# EAGLE design board1 (EAGLE 9.6.2)
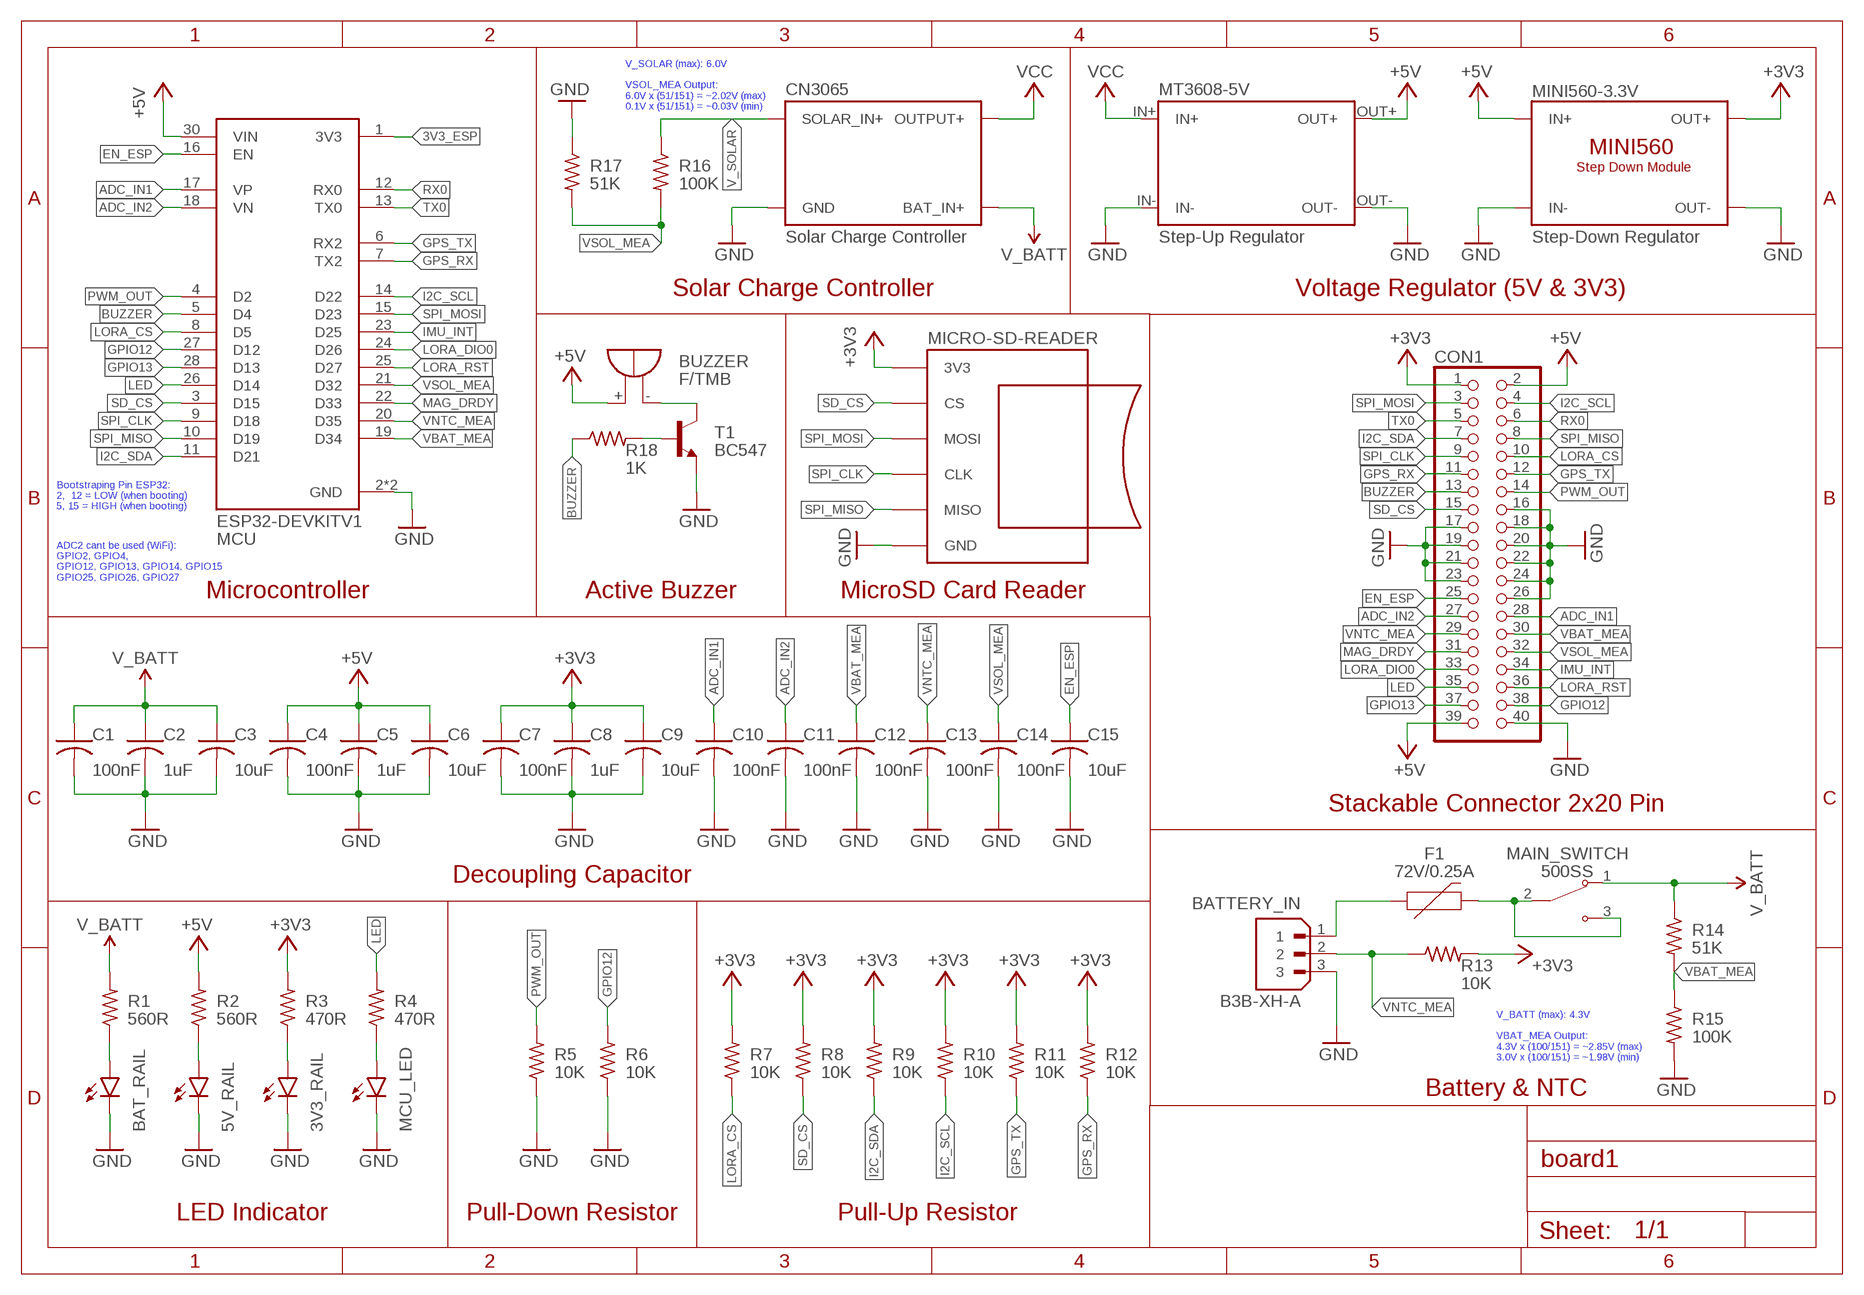
[diagram p0: schematic, sheet 1]

## Parts
3V3_RAIL  LEDCHIP-LED0805  [CHIP-LED0805]
5V_RAIL  LEDCHIP-LED0805  [CHIP-LED0805]
BAT_RAIL  LEDCHIP-LED0805  [CHIP-LED0805]
BATTERY_IN  B3B-XH-A  [JST_B3B-XH-A]
BUZZER  F/TMB  [F/TMB]
C1  100nF  C-USC0805  [C0805]
C2  1uF  C-USC0805  [C0805]
C3  10uF  C-USC0805  [C0805]
C4  100nF  C-USC0805  [C0805]
C5  1uF  C-USC0805  [C0805]
C6  10uF  C-USC0805  [C0805]
C7  100nF  C-USC0805  [C0805]
C8  1uF  C-USC0805  [C0805]
C9  10uF  C-USC0805  [C0805]
C10  100nF  C-USC0805  [C0805]
C11  100nF  C-USC0805  [C0805]
C12  100nF  C-USC0805  [C0805]
C13  100nF  C-USC0805  [C0805]
C14  100nF  C-USC0805  [C0805]
C15  10uF  C-USC0805  [C0805]
CN3065  Solar Charge Controller  CN3065  [CN3065]
CON1  PINHD-2X20  [2X20]
ESP32-DEVKITV1  MCU  ESP32-DEVKIT-V1  [MODULE_ESP32_DEVKIT_V1]
F1  72V/0.25A  PPTC_PTH  [PTH]
MAIN_SWITCH  500SS  500SSP1S1M2REA  [SW_500SSP1S1M2REA]
MCU_LED  LEDCHIP-LED0805  [CHIP-LED0805]
MICRO-SD-READER  MICROSD-READERUP-TOP  [MICROSD-READER-FACING_UP(TOP_LAYER)]
MINI560-3.3V  Step-Down Regulator  MINI560_W/O_ENTHT  [MINI560-THT]
MT3608-5V  Step-Up Regulator  MT3608  [MT3608]
R1  560R  R-US_R0805  [R0805]
R2  560R  R-US_R0805  [R0805]
R3  470R  R-US_R0805  [R0805]
R4  470R  R-US_R0805  [R0805]
R5  10K  R-US_R0805  [R0805]
R6  10K  R-US_R0805  [R0805]
R7  10K  R-US_R0805  [R0805]
R8  10K  R-US_R0805  [R0805]
R9  10K  R-US_R0805  [R0805]
R10  10K  R-US_R0805  [R0805]
R11  10K  R-US_R0805  [R0805]
R12  10K  R-US_R0805  [R0805]
R13  10K  R-US_R0805  [R0805]
R14  51K  R-US_R0805  [R0805]
R15  100K  R-US_R0805  [R0805]
R16  100K  R-US_R0805  [R0805]
R17  51K  R-US_R0805  [R0805]
R18  1K  R-US_R0805  [R0805]
T1  BC547  [TO92]

## Nets
3V3_ESP: ESP32-DEVKITV1.1(3V3)
+3V3: C7.1 C8.1 C9.1 CON1.1 MICRO-SD-READER.3V3 MINI560-3.3V.1OUT+(OUT+) MINI560-3.3V.2OUT+(OUT+) R3.2 R7.2 R8.2 R9.2 R10.2 R11.2 R12.2 R13.2
+5V: BUZZER.+ C4.1 C5.1 C6.1 CON1.2 CON1.39 ESP32-DEVKITV1.30(VIN) MINI560-3.3V.1IN+(IN+) MINI560-3.3V.2IN+(IN+) MT3608-5V.OUT+ R2.2
ADC_IN1: C10.1 CON1.28 ESP32-DEVKITV1.17(VP)
ADC_IN2: C11.1 CON1.27 ESP32-DEVKITV1.18(VN)
BUZZER: CON1.13 ESP32-DEVKITV1.5(D4) R18.1
EN_ESP: C15.1 CON1.25 ESP32-DEVKITV1.16(EN)
GND: 3V3_RAIL.C 5V_RAIL.C BAT_RAIL.C BATTERY_IN.3 C1.2 C2.2 C3.2 C4.2 C5.2 C6.2 C7.2 C8.2 C9.2 C10.2 C11.2 C12.2 C13.2 C14.2 C15.2 CN3065.BAT-(GND) CN3065.OUT-(GND) CN3065.SC-(GND) CON1.16 CON1.17 CON1.18 CON1.19 CON1.20 CON1.21 CON1.22 CON1.23 CON1.24 CON1.26 CON1.40 ESP32-DEVKITV1.2(GND) ESP32-DEVKITV1.29(GND) MCU_LED.C MICRO-SD-READER.GND MINI560-3.3V.1IN-(IN-) MINI560-3.3V.1OUT-(OUT-) MINI560-3.3V.2IN-(IN-) MINI560-3.3V.2OUT-(OUT-) MT3608-5V.IN- MT3608-5V.OUT- R5.1 R6.1 R15.2 R17.1 T1.1(E)
GPIO12: CON1.38 ESP32-DEVKITV1.27(D12) R6.2
GPIO13: CON1.37 ESP32-DEVKITV1.28(D13)
GPS_RX: CON1.11 ESP32-DEVKITV1.7(TX2) R12.1
GPS_TX: CON1.12 ESP32-DEVKITV1.6(RX2) R11.1
I2C_SCL: CON1.4 ESP32-DEVKITV1.14(D22) R10.1
I2C_SDA: CON1.7 ESP32-DEVKITV1.11(D21) R9.1
IMU_INT: CON1.34 ESP32-DEVKITV1.23(D25)
LED: CON1.35 ESP32-DEVKITV1.26(D14) R4.2
LORA_CS: CON1.10 ESP32-DEVKITV1.8(D5) R7.1
LORA_DIO0: CON1.33 ESP32-DEVKITV1.24(D26)
LORA_RST: CON1.36 ESP32-DEVKITV1.25(D27)
MAG_DRDY: CON1.31 ESP32-DEVKITV1.22(D33)
N$1: BATTERY_IN.1 F1.P$1
N$2: BUZZER.- T1.3(C)
N$3: F1.P$2 MAIN_SWITCH.2(COM) MAIN_SWITCH.3(NO)
N$4: R18.2 T1.2(B)
N$5: MCU_LED.A R4.1
N$6: 3V3_RAIL.A R3.1
N$8: BAT_RAIL.A R1.1
N$11: 5V_RAIL.A R2.1
PWM_OUT: CON1.14 ESP32-DEVKITV1.4(D2) R5.2
RX0: CON1.6 ESP32-DEVKITV1.12(RX0)
SD_CS: CON1.15 ESP32-DEVKITV1.3(D15) MICRO-SD-READER.CS R8.1
SPI_CLK: CON1.9 ESP32-DEVKITV1.9(D18) MICRO-SD-READER.CLK
SPI_MISO: CON1.8 ESP32-DEVKITV1.10(D19) MICRO-SD-READER.MISO
SPI_MOSI: CON1.3 ESP32-DEVKITV1.15(D23) MICRO-SD-READER.MOSI
TX0: CON1.5 ESP32-DEVKITV1.13(TX0)
V_BATT: C1.1 C2.1 C3.1 CN3065.BAT+(BAT_IN+) MAIN_SWITCH.1(NC) R1.2 R14.1
V_SOLAR: CN3065.SC+(SOLAR_IN+) R16.1
VBAT_MEA: C12.1 CON1.30 ESP32-DEVKITV1.19(D34) R14.2 R15.1
VCC: CN3065.OUT+(OUTPUT+) MT3608-5V.IN+
VNTC_MEA: BATTERY_IN.2 C13.1 CON1.29 ESP32-DEVKITV1.20(D35) R13.1
VSOL_MEA: C14.1 CON1.32 ESP32-DEVKITV1.21(D32) R16.2 R17.2

## Notes on the sheet
- V_SOLAR (max): 6.0V
  
  VSOL_MEA Output: 
  6.0V x (51/151) = ~2.02V (max)
  0.1V x (51/151) = ~0.03V (min)
- Solar Charge Controller | Voltage Regulator (5V & 3V3)
- Bootstraping Pin ESP32:
  2,  12 = LOW (when booting)
  5, 15 = HIGH (when booting)
- ADC2 cant be used (WiFi):
  GPIO2, GPIO4, 
  GPIO12, GPIO13, GPIO14, GPIO15
  GPIO25, GPIO26, GPIO27
- Microcontroller | Active Buzzer | MicroSD Card Reader
- Stackable Connector 2x20 Pin
- Decoupling Capacitor
- V_BATT (max): 4.3V
  
  VBAT_MEA Output: 
  4.3V x (100/151) = ~2.85V (max)
  3.0V x (100/151) = ~1.98V (min)
- Battery & NTC
- LED Indicator | Pull-Down Resistor | Pull-Up Resistor

## Library data of the parts
3V3_RAIL 5V_RAIL BAT_RAIL MCU_LED = led:LED: LED OSRAM: - CHIPLED LG R971, LG N971, LY N971, LG Q971, LY Q971, LO R971, LY R971 LH N974, LH R974 LS Q976, LO Q976, LY Q976 LO Q996 - Hyper CHIPLED LW Q18S LB Q993, LB Q99A, LB R99A - SideLED LS A670, LO A670, LY A670, LG A670, LP A670 LB A673, LV A673, LT A673, LW A673 LH A674 LY A675 LS A676, LA A676, LO A676, LY A676, LW A676 LS A679, LY A679, LG A679 - Hyper Micro SIDELED® LS Y876, LA Y876, LO Y876, LY Y876 LT Y87S - SmartLED LW L88C, LW L88S LB L89C, LB L89S, LG L890 LS L89K, LO L89K, LY L89K LS L896, LA L896, LO L896, LY L896 - TOPLED LS T670, LO T670, LY T670, LG T670, LP T670 LSG T670, LSP T670, LSY T670, LOP T670, LYG T670 LG T671, LOG T671, LSG T671 LB T673, LV T673, LT T673, LW T673 LH T674 LS T676, LA T676, LO T676, LY T676, LB T676, LH T676, LSB T676, LW T676 LB T67C, LV T67C, LT T67C, LS T67K, LO T67K, LY T67K, LW E67C LS E67B, LA E67B, LO E67B, LY E67B, LB E67C, LV E67C, LT E67C LW T67C LS T679, LY T679, LG T679 LS T770, LO T770, LY T770, LG T770, LP T770 LB T773, LV T773, LT T773, LW T773 LH T774 LS E675, LA E675, LY E675, LS T675 LS T776, LA T776, LO T776, LY T776, LB T776 LHGB T686 LT T68C, LB T68C - Hyper Mini TOPLED® LB M676 - Mini TOPLED Santana® LG M470 LS M47K, LO M47K, LY M47K Source: http://www.osram.convergy.de LUXEON: - LUMILED® LXK2-PW12-R00, LXK2-PW12-S00, LXK2-PW14-U00, LXK2-PW14-V00 LXK2-PM12-R00, LXK2-PM12-S00, LXK2-PM14-U00 LXK2-PE12-Q00, LXK2-PE12-R00, LXK2-PE12-S00, LXK2-PE14-T00, LXK2-PE14-U00 LXK2-PB12-K00, LXK2-PB12-L00, LXK2-PB12-M00, LXK2-PB14-N00, LXK2-PB14-P00, LXK2-PB14-Q00 LXK2-PR12-L00, LXK2-PR12-M00, LXK2-PR14-Q00, LXK2-PR14-R00 LXK2-PD12-Q00, LXK2-PD12-R00, LXK2-PD12-S00 LXK2-PH12-R00, LXK2-PH12-S00 LXK2-PL12-P00, LXK2-PL12-Q00, LXK2-PL12-R00 Source: www.luxeon.com KINGBRIGHT: KA-3528ASYC Source: www.kingbright.com
BATTERY_IN = B3B-XH-A:B3B-XH-A: Check availability <https://pricing.snapeda.com/parts/B3B-XH-A/JST%20Sales/view-part?ref=eda>; AVAILABILITY: In Stock; CHECK_PRICES: https://www.snapeda.com/parts/B3B-XH-A/JST+Sales+America+Inc./view-part/?ref=eda; DESCRIPTION: Connector Header Through Hole 3 position 0.098 (2.50mm); MF: JST Sales; MP: B3B-XH-A; PACKAGE: None; PRICE: None; PURCHASE-URL: https://www.snapeda.com/api/url_track_click_mouser/?unipart_id=557442&manufacturer=JST Sales&part_name=B3B-XH-A&search_term=b3b-xh; SNAPEDA_LINK: https://www.snapeda.com/parts/B3B-XH-A/JST+Sales+America+Inc./view-part/?ref=snap
BUZZER = buzzer:F/TMB: BUZZER Source: Buerklin; OC_FARNELL: unknown; OC_NEWARK: unknown
C1-C15 = rcl:C-US: CAPACITOR, American symbol; SPICEPREFIX: C
CN3065 = CN3065:CN3065
CON1 = pinhead:PINHD-2X20: PIN HEADER
ESP32-DEVKITV1 = ESP32-DEVKIT-V1:ESP32-DEVKIT-V1: Check availability <https://pricing.snapeda.com/parts/ESP32-DEVKIT-V1/Do%20it/view-part?ref=eda>; AVAILABILITY: Not in stock; CHECK_PRICES: https://www.snapeda.com/parts/ESP32-DEVKIT-V1/Do+it/view-part/?ref=eda; DESCRIPTION: Dual core, Wi-Fi: 2.4 GHz up to 150 Mbits/s,BLE (Bluetooth Low Energy) and legacy Bluetooth, 32 bits, Up to 240 MHz; MF: Do it; MP: ESP32-DEVKIT-V1; PACKAGE: None; PRICE: None; SNAPEDA_LINK: https://www.snapeda.com/parts/ESP32-DEVKIT-V1/Do+it/view-part/?ref=snap
F1 = SparkFun-Fuses:PPTC: Resettable Fuse PPTC Resettable Fuse. Really a sort of resistor with a polymeric positive temperature coefficient whose resistance increases dramatically with an increase in temperature. When heated by the power passing through the resistance rises causing the current to be limited, protecting the circuit. This is achieved by the transition of the polymer from a crystalline to an amorphous state where the conductive carbon separates breaking the conductive pathways found in the cool crystalline structure. When a PPTC cools back down it resumes conducting letting the circuit turn back on. SparkFun Products: SparkFun RedBoard - Programmed with Arduino <https://www.sparkfun.com/products/12757> Pro Micro - 5V/16MHz <https://www.sparkfun.com/products/12640> Arduino Pro 328 - 5V/16MHz <https://www.sparkfun.com/products/10915> MP3 Trigger <https://www.sparkfun.com/products/13720>; PROD_ID: RES-08490
MAIN_SWITCH = 500SSP1S1M2REA:500SSP1S1M2REA: Slide Switch SPDT Through Hole Check availability <https://pricing.snapeda.com/parts/500SSP1S1M2REA/E-Switch/view-part?ref=eda> Check availability <https://pricing.snapeda.com/parts/500SSP1S1M2REA/E-Switch/view-part?ref=eda> Check availability <https://pricing.snapeda.com/parts/500SSP1S1M2REA/E-Switch/view-part?ref=eda>; AVAILABILITY: In Stock; DESCRIPTION: SWITCH SLIDE SPDT 0.4VA 20V; MF: E-Switch; MP: 500SSP1S1M2REA; PACKAGE: None; PRICE: None; PURCHASE-URL: https://pricing.snapeda.com/search?q=500SSP1S1M2REA&ref=eda
MICRO-SD-READER = MicroSD-Reader:MICROSD-READER
MINI560-3.3V = MINI560:MINI560_W/O_EN
MT3608-5V = MT3608:MT3608
R1-R18 = rcl:R-US_: RESISTOR, American symbol; SPICEPREFIX: R
T1 = transistor:BC547: NPN TRANSISTOR

## Board
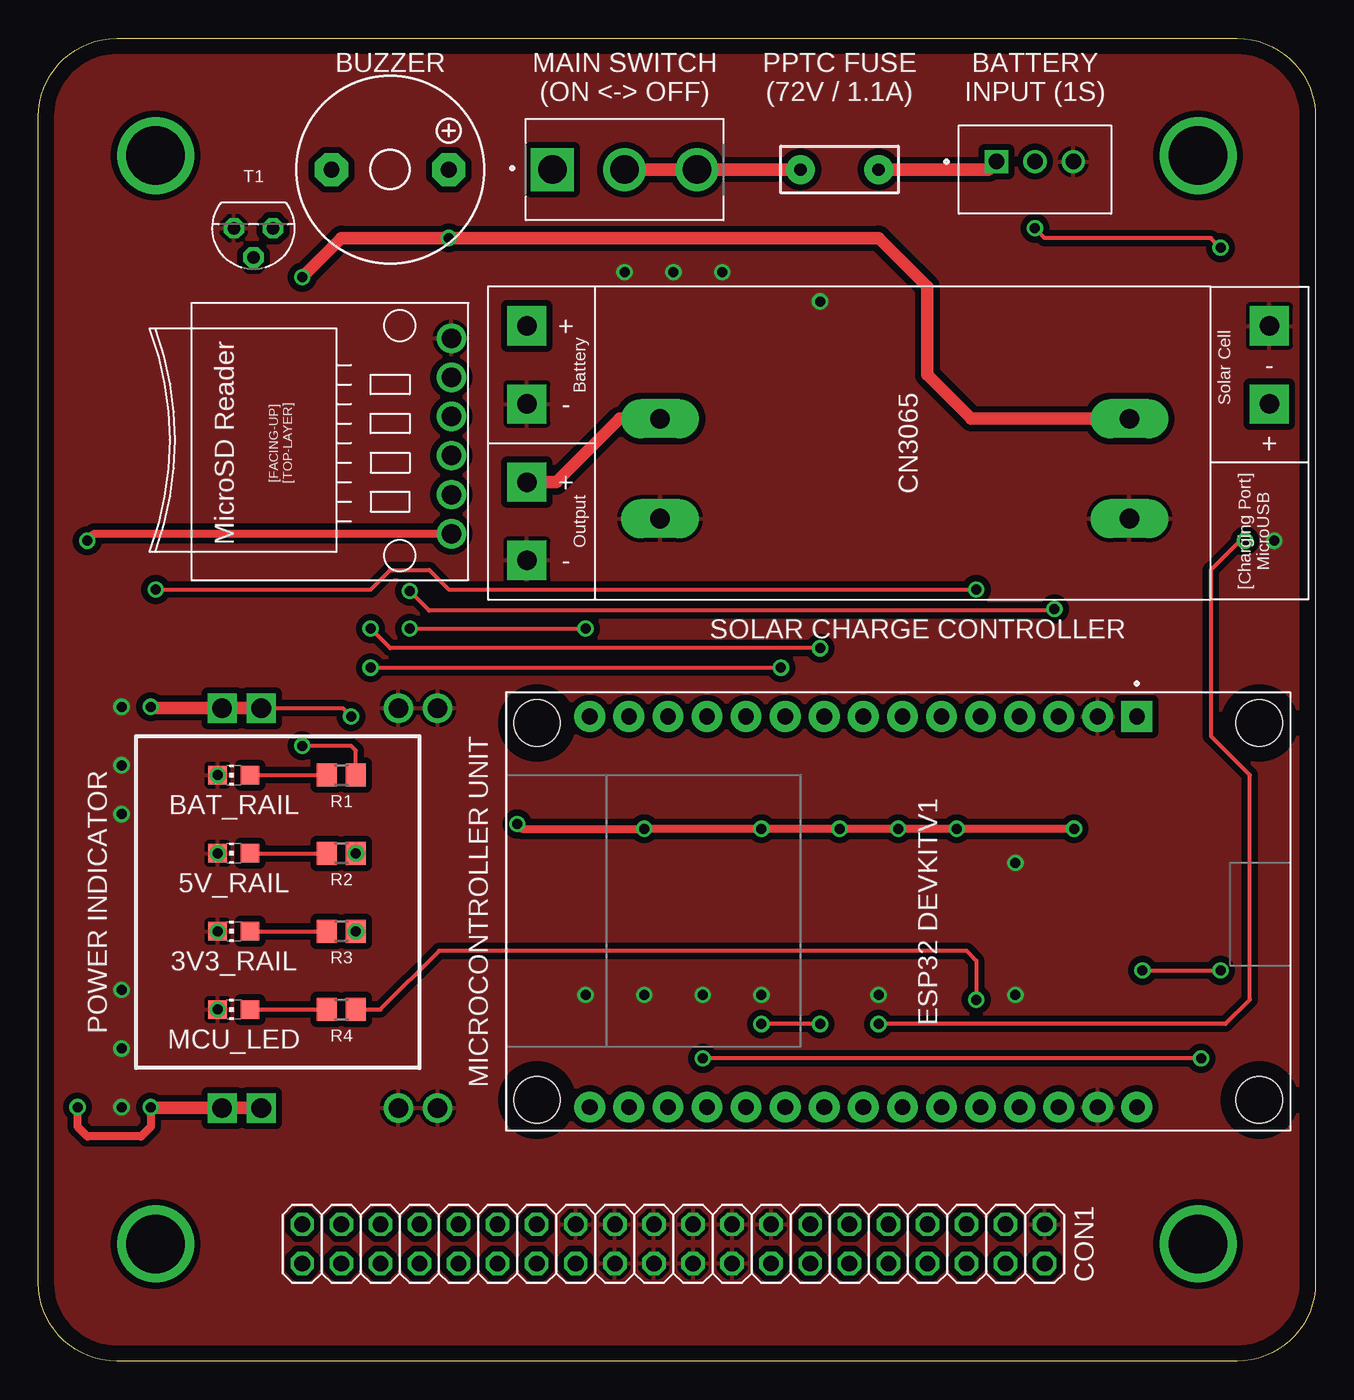
[diagram p1: board, top side]
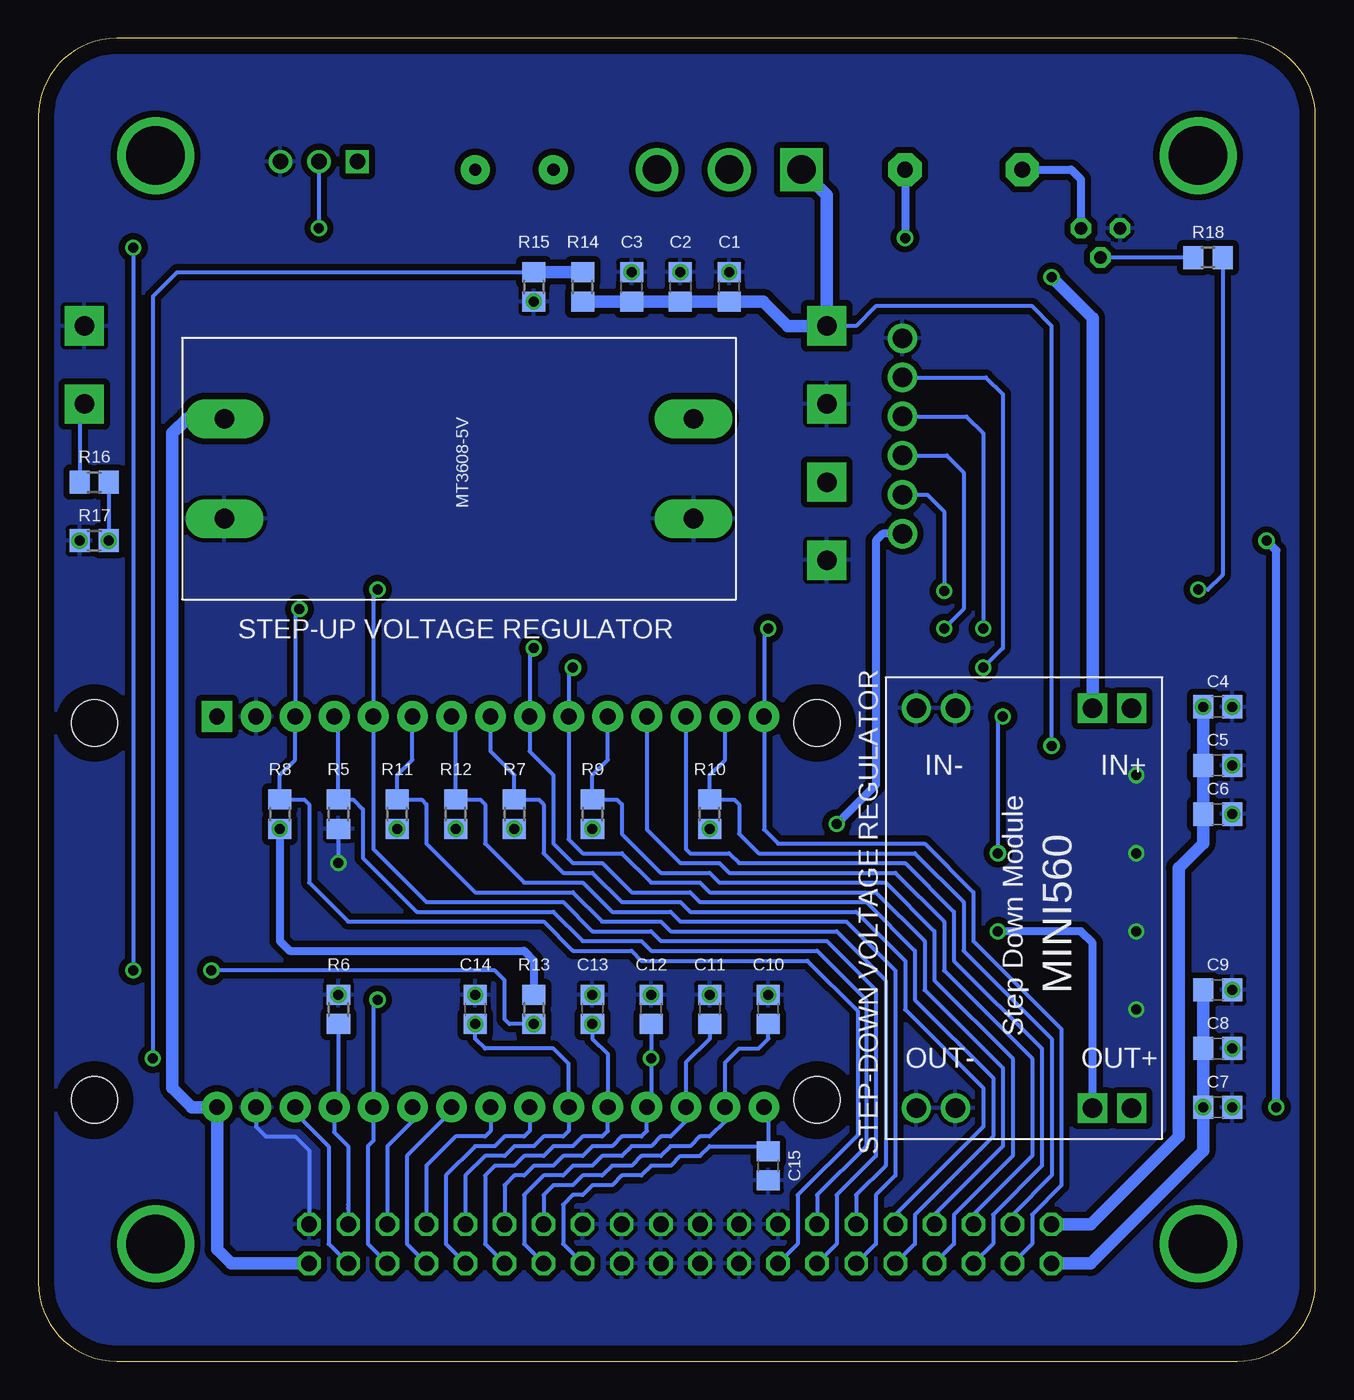
[diagram p2: board, bottom side, seen from below]

Size 83 x 86 mm. Coordinates in mm from the lower left corner, seen from the top.
Outline: 5.08,0 arc-90 0,5.08 0,80.92 arc-90 5.08,86 77.92,86 arc-90 83,80.92 83,5.08 arc-90 77.92,0 5.08,0
Copper layers (1*16): Top 0.035mm / dielectric 1.5mm / Bottom 0.035mm
Design rules "default *": minimum track width 6mil, minimum drill 0.35mm, track to track 11mil, track to pad 11mil, pad to pad 11mil, via to via 11mil, smd to smd 6mil, copper to edge 40mil, drill to drill 11mil, minimum pad ring 10mil, minimum via ring 8mil, stop-mask expansion 4mil, vias tented up to drill 0mil, thermal gap 10mil

### Footprints (pad centres in the part's own frame; a part is rotated, then mirrored left to right if it is on the bottom)
CHIP-LED0805 = smd 1.2 x 1.2: A 0,-1.05; C 0,1.05
JST_B3B-XH-A = drill 1 square: 1 2.5,-0.525 | drill 1: 2 0,-0.525; 3 -2.5,-0.525
F/TMB = drill 1.016 pad 2.159 octagon: + 3.81,0; - -3.81,0
C0805 = smd 1.3 x 1.5: 1 -0.95,0; 2 0.95,0
CN3065 = drill 1.27 pad 2.54 square: BAT+ 44.45,2.54; BAT- 44.45,7.62; OUT+ 44.45,12.7; OUT- 44.45,17.78; SC+ -3.81,7.62; SC- -3.81,2.54
2X20 = drill 1.016 octagon: 1 -24.13,-1.27; 2 -24.13,1.27; 3 -21.59,-1.27; 4 -21.59,1.27; 5 -19.05,-1.27; 6 -19.05,1.27; 7 -16.51,-1.27; 8 -16.51,1.27; 9 -13.97,-1.27; 10 -13.97,1.27; 11 -11.43,-1.27; 12 -11.43,1.27; 13 -8.89,-1.27; 14 -8.89,1.27; 15 -6.35,-1.27; 16 -6.35,1.27; 17 -3.81,-1.27; 18 -3.81,1.27; 19 -1.27,-1.27; 20 -1.27,1.27; 21 1.27,-1.27; 22 1.27,1.27; 23 3.81,-1.27; 24 3.81,1.27; 25 6.35,-1.27; 26 6.35,1.27; 27 8.89,-1.27; 28 8.89,1.27; 29 11.43,-1.27; 30 11.43,1.27; 31 13.97,-1.27; 32 13.97,1.27; 33 16.51,-1.27; 34 16.51,1.27; 35 19.05,-1.27; 36 19.05,1.27; 37 21.59,-1.27; 38 21.59,1.27; 39 24.13,-1.27; 40 24.13,1.27
MODULE_ESP32_DEVKIT_V1 = drill 1.02 pad 2 square: 1 -12.7,15.515 | drill 1.02 pad 2: 2 -12.7,12.975; 3 -12.7,10.435; 4 -12.7,7.895; 5 -12.7,5.355; 6 -12.7,2.815; 7 -12.7,0.275; 8 -12.7,-2.265; 9 -12.7,-4.805; 10 -12.7,-7.345; 11 -12.7,-9.885; 12 -12.7,-12.425; 13 -12.7,-14.965; 14 -12.7,-17.505; 15 -12.7,-20.045; 16 12.7,-20.045; 17 12.7,-17.505; 18 12.7,-14.965; 19 12.7,-12.425; 20 12.7,-9.885; 21 12.7,-7.345; 22 12.7,-4.805; 23 12.7,-2.265; 24 12.7,0.275; 25 12.7,2.815; 26 12.7,5.355; 27 12.7,7.895; 28 12.7,10.435; 29 12.7,12.975; 30 12.7,15.515 | hole 3: -12.28,-23.475; 12.23,-23.475; 12.23,23.475; -12.28,23.475
PTH = drill 0.8 pad 1.88: P$1 -2.54,0; P$2 2.54,0
SW_500SSP1S1M2REA = drill 1.85 square: 1 -4.7,0 | drill 1.85: 2 0,0; 3 4.7,0
MICROSD-READER-FACING_UP(TOP_LAYER) = drill 1.27: 3V3 3,1.1; CLK 10.62,1.1; CS 5.54,1.1; GND 15.7,1.1; MISO 13.16,1.1; MOSI 8.08,1.1
MINI560-THT = drill 1.27 square: 1IN+ 2,16; 1OUT+ 28,16; 2IN+ 2,13.46; 2OUT+ 28,13.46 | drill 1.27: 1IN- 2,4.54; 1OUT- 28,4.54; 2IN- 2,2; 2OUT- 28,2
MT3608 = drill 1.27 pad 2.54 long: IN+ 33.25,11.75; IN- 33.25,5.25; OUT+ 2.75,11.75; OUT- 2.75,5.25
R0805 = smd 1.3 x 1.5: 1 -0.95,0; 2 0.95,0
TO92 = drill 0.813 octagon: 1 1.27,0; 2 0,1.905; 3 -1.27,0

### Placement (x,y rotation side)
3V3_RAIL  12.7,27.94 90 top
5V_RAIL  12.7,33.02 90 top
BAT_RAIL  12.7,38.1 90 top
BATTERY_IN  64.77,77.47 180 top
BUZZER  22.86,77.47 0 top
C1  38.1,69.85 90 bottom
C2  41.27,69.85 90 bottom
C3  44.45,69.85 90 bottom
C4  6.35,42.55 0 bottom
C5  6.35,38.73 0 bottom
C6  6.35,35.56 0 bottom
C7  6.35,16.51 0 bottom
C8  6.35,20.32 0 bottom
C9  6.35,24.13 0 bottom
C10  35.56,22.86 90 bottom
C11  39.37,22.86 90 bottom
C12  43.18,22.86 90 bottom
C13  46.99,22.86 90 bottom
C14  54.61,22.86 90 bottom
C15  35.56,12.7 270 bottom
CN3065  76.2,69.85 180 top
CON1  41.27,7.62 0 top
ESP32-DEVKITV1  55.88,29.21 270 top
F1  52.07,77.47 180 top
MAIN_SWITCH  38.1,77.47 0 top
MCU_LED  12.7,22.86 90 top
MICRO-SD-READER  27.94,50.8 90 top
MINI560-3.3V  27.94,44.45 270 bottom
MT3608-5V  73.66,49.53 0 bottom
R1  19.68,38.1 0 top
R2  19.68,33.02 0 top
R3  19.68,27.94 0 top
R4  19.68,22.86 0 top
R5  63.5,35.56 90 bottom
R6  63.5,22.86 270 bottom
R7  52.07,35.56 270 bottom
R8  67.31,35.56 270 bottom
R9  46.99,35.56 270 bottom
R10  39.37,35.56 270 bottom
R11  59.69,35.56 270 bottom
R12  55.88,35.56 270 bottom
R13  50.8,22.86 90 bottom
R14  47.62,69.85 90 bottom
R15  50.8,69.85 270 bottom
R16  79.38,57.15 0 bottom
R17  79.38,53.34 0 bottom
R18  6.99,71.75 180 bottom
T1  13.97,73.66 180 top

### Tracks (layer width: path | path; a pad name or v marks a point on that pad's centre or on a via)
+3V3  (via drill 0.65)
  Top 0.508: R8.2 R11.2 R12.2 R7.2 R9.2 R10.2 31.43,34.61 v31.11,34.92 | v3.17,53.34 3.63,53.8 MICRO-SD-READER.3V3 | C7.1 7.3,15.24 6.67,14.61 3.17,14.61 2.54,15.24 v2.54,16.51
  Top 0.813: MINI560-3.3V.2OUT+ MINI560-3.3V.1OUT+ 7.36,16.45 C7.1
  Bottom 0.508: v2.54,16.51 2.54,52.7 v3.17,53.34 | MICRO-SD-READER.3V3 28.11,53.8 28.57,53.34 28.57,37.47 v31.11,34.92 | MINI560-3.3V.2OUT+ 14.48,27.18 15.24,27.94 v20.64,27.94 | R8.2 67.31,27.3 66.67,26.67 51.44,26.67 50.8,26.04 R13.2
  Bottom 0.813: C9.1 C8.1 C7.1 7.3,13.65 14.61,6.35 CON1.1
  other vias: 7.3,16.51 67.31,34.61 59.69,34.61 55.88,34.61 52.07,34.61 46.99,34.61 39.37,34.61
+5V  (via drill 0.65)
  Top 0.254: MINI560-3.3V.2IN+ 19.78,42.45 v20.32,41.91
  Top 0.813: MINI560-3.3V.2IN+ MINI560-3.3V.1IN+ 7.39,42.45 C4.1 | v17.14,70.48 19.68,73.03 v26.67,73.03 54.61,73.03 57.78,69.85 57.78,64.14 60.64,61.28 MT3608-5V.OUT+
  Bottom 0.254: v20.32,41.91 20.64,41.59 v20.64,33.02
  Bottom 0.508: BUZZER.+ v26.67,73.03
  Bottom 0.813: C4.1 C5.1 C6.1 7.3,33.66 8.89,32.06 8.89,14.61 14.61,8.89 CON1.2 | MINI560-3.3V.2IN+ 14.48,67.82 v17.14,70.48 | MT3608-5V.OUT+ 73.34,61.28 74.3,60.33 74.3,17.78 73.03,16.51 ESP32-DEVKITV1.30 71.39,7.26 70.48,6.35 CON1.39
  other vias: 7.3,42.55
ADC_IN1
  Bottom 0.254: CON1.28 50.16,10.79 49.53,11.43 48.26,11.43 47.62,12.06 46.35,12.06 45.72,12.7 44.45,12.7 43.81,13.34 42.55,13.34 41.91,13.97 40.64,13.97 40.01,14.61 39.37,14.61 38.38,15.6 ESP32-DEVKITV1.17 38.38,19.41 37.47,20.32 36.2,20.32 35.56,20.95 C10.1
ADC_IN2
  Bottom 0.254: C11.1 39.37,20.95 40.91,19.41 ESP32-DEVKITV1.18 40.91,15.6 41.91,14.61 42.55,14.61 43.18,13.97 44.45,13.97 45.09,13.34 46.35,13.34 46.99,12.7 48.26,12.7 48.9,12.06 50.16,12.06 51.44,10.79 51.44,7.62 CON1.27
BUZZER  (via drill 0.65)
  Top 0.254: v7.62,50.16 21.59,50.16 22.86,51.44 25.4,51.44 26.67,50.16 v60.96,50.16
  Bottom 0.254: R18.1 6.04,51.12 6.99,50.16 v7.62,50.16 | v60.96,50.16 61.23,49.89 ESP32-DEVKITV1.5 61.23,33.3 57.78,29.84 48.9,29.84 46.99,27.94 43.18,27.94 42.55,27.3 31.75,27.3 28.57,24.13 28.57,13.34 31.11,10.79 31.11,7.62 CON1.13
EN_ESP
  Bottom 0.254: CON1.25 48.9,7.62 48.9,10.16 48.26,10.79 47.62,10.79 46.99,11.43 45.72,11.43 45.09,12.06 43.81,12.06 43.18,12.7 41.91,12.7 41.27,13.34 40.01,13.34 39.37,13.97 35.88,13.97 C15.1 35.56,16.23 ESP32-DEVKITV1.16
GND  (via drill 0.65)
  Bottom 0.254: ESP32-DEVKITV1.29 68.86,15.24 68.22,14.61 66.31,14.61 65.41,13.7 CON1.40 | R5.1 v63.5,32.38
  other vias: 35.56,23.81 39.37,23.81 43.18,23.81 46.99,23.81 54.61,23.81 63.5,23.81 11.65,27.94 11.65,22.86 5.4,20.32 5.4,24.13 5.4,35.56 5.4,38.73 5.4,42.55 11.65,33.02 11.65,38.1 80.33,53.34 38.1,70.8 41.27,70.8 44.45,70.8 50.8,68.9 5.4,16.51
  pour Top (isolate 0.406): -1.78,87.63 85.09,87.63 85.09,-1.91 -1.94,-1.91
  pour Bottom (isolate 0.406): -1.27,87 84.45,87 84.45,-1.27 -1.27,-1.27
GPIO12
  Bottom 0.254: R6.2 63.5,16.79 ESP32-DEVKITV1.27 63.77,14.88 62.87,13.97 62.87,10.16 62.87,9.93 CON1.38
GPIO13
  Bottom 0.254: ESP32-DEVKITV1.28 66.31,16.15 64.14,13.97 64.14,7.62 CON1.37
GPS_RX
  Bottom 0.254: ESP32-DEVKITV1.7 55.88,41.63 R12.1 54.29,36.51 53.98,36.2 53.98,33.66 51.44,31.11 47.62,31.11 45.72,29.21 41.91,29.21 41.27,28.57 30.48,28.57 27.3,25.4 27.3,12.06 28.57,10.79 28.57,7.62 CON1.11
GPS_TX
  Bottom 0.254: ESP32-DEVKITV1.6 58.7,39.09 59.69,38.1 R11.1 58.1,36.51 57.78,36.2 57.78,33.66 54.61,30.48 48.26,30.48 46.35,28.57 42.55,28.57 41.91,27.94 31.11,27.94 27.94,24.77 27.94,12.7 29.84,10.79 CON1.12
I2C_SCL
  Bottom 0.254: ESP32-DEVKITV1.14 38.38,39.09 39.37,38.1 R10.1 37.78,36.51 37.47,36.2 37.47,34.29 36.2,33.02 26.04,33.02 22.86,29.84 22.86,26.67 17.14,20.95 17.14,12.06 19.68,9.53 CON1.4
I2C_SDA
  Bottom 0.254: ESP32-DEVKITV1.11 45.99,39.09 46.99,38.1 R9.1 45.4,36.51 45.09,36.2 45.09,34.29 42.55,31.75 39.37,31.75 38.73,31.11 27.94,31.11 24.77,27.94 24.77,24.77 19.68,19.68 19.68,13.34 23.5,9.53 23.5,7.62 CON1.7
IMU_INT
  Bottom 0.254: ESP32-DEVKITV1.23 53.62,14.96 53.98,14.61 55.88,14.61 57.78,12.7 CON1.34
LED  (via drill 0.65)
  Top 0.254: R4.2 22.23,22.86 26.04,26.67 60.33,26.67 60.96,26.04 v60.96,23.5
  Bottom 0.254: v60.96,23.5 61.23,23.22 ESP32-DEVKITV1.26 61.23,14.33 61.59,13.97 61.59,7.62 CON1.35
LORA_CS
  Bottom 0.254: ESP32-DEVKITV1.8 53.62,39.65 52.07,38.1 R7.1 50.48,36.51 50.16,36.2 50.16,33.02 48.9,31.75 46.99,31.75 45.09,29.84 41.27,29.84 40.64,29.21 29.84,29.21 26.67,26.04 26.67,22.86 21.59,17.78 21.59,15.24 27.3,9.53 CON1.10
LORA_DIO0
  Bottom 0.254: ESP32-DEVKITV1.24 56.16,16.23 59.05,13.34 59.05,7.62 CON1.33
LORA_RST
  Bottom 0.254: ESP32-DEVKITV1.25 58.7,15.6 60.33,13.97 CON1.36
MAG_DRDY
  Bottom 0.254: ESP32-DEVKITV1.22 51.08,14.96 51.44,14.61 52.7,14.61 53.34,13.97 54.61,13.97 56.52,12.06 56.52,7.62 CON1.31
N$1
  Top 0.813: BATTERY_IN.1 61.74,77.47 F1.P$1
N$2
  Bottom 0.508: BUZZER.- 15.88,77.47 15.24,76.83 T1.3
N$3
  Top 0.813: F1.P$2 MAIN_SWITCH.3 MAIN_SWITCH.2
N$4
  Bottom 0.254: R18.2 T1.2
N$5
  Top 0.254: MCU_LED.A R4.1
N$6
  Top 0.254: 3V3_RAIL.A R3.1
N$7  (via drill 3.8 pad 5)
  other vias: 7.62,7.62
N$8
  Top 0.254: BAT_RAIL.A R1.1
N$9  (via drill 3.8 pad 5)
  other vias: 75.38,7.62
N$10  (via drill 3.8 pad 5)
  other vias: 7.62,78.38
N$11
  Top 0.254: 5V_RAIL.A R2.1
N$12  (via drill 3.8 pad 5)
  other vias: 75.38,78.38
PWM_OUT
  Bottom 0.254: ESP32-DEVKITV1.4 63.5,41.63 R5.2 62.55,36.51 61.91,35.88 61.91,32.7 58.42,29.21 49.53,29.21 47.62,27.3 43.81,27.3 43.18,26.67 32.38,26.67 29.21,23.5 29.21,13.97 32.38,10.79 CON1.14
RX0
  Bottom 0.254: ESP32-DEVKITV1.12 43.45,34.56 41.27,32.38 38.73,32.38 38.1,31.75 27.3,31.75 24.13,28.57 24.13,25.4 18.41,19.68 18.41,13.34 22.23,9.53 CON1.6
SD_CS  (via drill 0.65)
  Top 0.254: v66.04,48.9 65.94,48.8 25.4,48.8 v24.13,50.07
  Bottom 0.254: MICRO-SD-READER.CS 25.23,56.34 24.13,55.24 v24.13,50.07 | v66.04,48.9 66.31,48.62 ESP32-DEVKITV1.3 66.31,39.09 67.31,38.1 R8.1 65.72,36.51 65.41,36.2 65.41,31.11 62.87,28.57 50.16,28.57 48.26,26.67 44.45,26.67 43.81,26.04 33.02,26.04 29.76,22.78 29.76,14.69 33.66,10.79 33.66,7.62 CON1.15
SPI_CLK  (via drill 0.65)
  Top 0.254: v50.8,46.35 22.86,46.35 v21.59,47.62
  Bottom 0.254: MICRO-SD-READER.CLK 22.68,61.42 21.59,60.33 v21.59,47.62 | v50.8,46.35 51.08,46.08 ESP32-DEVKITV1.9 51.08,39.65 49.53,38.1 49.53,33.66 48.26,32.38 46.35,32.38 44.45,30.48 40.64,30.48 40.01,29.84 29.21,29.84 26.04,26.67 26.04,23.5 20.95,18.41 20.95,14.61 26.04,9.53 26.04,7.62 CON1.9
SPI_MISO  (via drill 0.65)
  Top 0.254: v21.59,45.09 v48.26,45.09
  Bottom 0.254: MICRO-SD-READER.MISO 21.41,63.96 20.32,62.87 20.32,46.35 v21.59,45.09 | v48.26,45.09 48.53,44.81 ESP32-DEVKITV1.10 48.53,33.93 47.62,33.02 45.09,33.02 43.18,31.11 40.01,31.11 39.37,30.48 28.57,30.48 25.4,27.3 25.4,24.13 20.32,19.05 20.32,13.97 24.77,9.53 CON1.8
SPI_MOSI  (via drill 0.65)
  Top 0.254: v24.13,47.62 v35.56,47.62
  Bottom 0.254: MICRO-SD-READER.MOSI 23.95,58.88 22.86,57.78 22.86,48.9 v24.13,47.62 | v35.56,47.62 35.84,47.35 ESP32-DEVKITV1.15 35.84,34.56 34.92,33.66 25.4,33.66 22.23,30.48 22.23,27.3 16.51,21.59 16.51,11.43 18.41,9.53 18.41,7.62 CON1.3
TX0
  Bottom 0.254: ESP32-DEVKITV1.13 40.91,33.3 40.64,33.02 38.1,33.02 37.47,32.38 26.67,32.38 23.5,29.21 23.5,26.04 17.78,20.32 17.78,12.7 20.95,9.53 20.95,7.62 CON1.5
V_BATT  (via drill 0.65)
  Top 0.254: R1.2 20.64,39.69 20.32,40.01 v17.14,40.01
  Bottom 0.254: CN3065.BAT+ 29.84,67.31 28.57,68.58 18.41,68.58 17.14,67.31 v17.14,40.01
  Bottom 0.813: MAIN_SWITCH.1 31.75,75.82 CN3065.BAT+ 34.29,67.31 35.88,68.9 C1.1 C2.1 C3.1 R14.1
V_SOLAR
  Bottom 0.254: CN3065.SC+ 80.33,61.91 R16.1
VBAT_MEA  (via drill 0.65)
  Top 0.254: v75.56,19.68 v43.18,19.68
  Bottom 0.254: v75.56,19.68 75.56,69.22 73.98,70.8 R15.1 | CON1.30 52.7,11.43 52.07,12.06 51.44,12.06 50.8,12.7 49.53,12.7 48.9,13.34 47.62,13.34 46.99,13.97 45.72,13.97 45.09,14.61 43.81,14.61 43.45,14.96 ESP32-DEVKITV1.19 43.18,16.79 v43.18,19.68 C12.1
  Bottom 0.813: R14.2 R15.1
VCC
  Top 0.813: CN3065.OUT+ 33.66,57.15 37.78,61.28 MT3608-5V.IN+
VNTC_MEA  (via drill 0.65)
  Top 0.254: v76.83,72.39 76.2,73.03 65.41,73.03 v64.77,73.66 | R13.1 C13.1 | v71.75,25.4 v76.83,25.4
  Bottom 0.254: C13.1 46.99,20.95 45.99,19.96 ESP32-DEVKITV1.20 45.99,14.96 46.35,14.61 47.62,14.61 48.26,13.97 49.53,13.97 50.16,13.34 51.44,13.34 52.07,12.7 53.34,12.7 53.98,12.06 53.98,7.62 CON1.29 | BATTERY_IN.2 v64.77,73.66 | v76.83,72.39 v76.83,25.4 | R13.1 52.39,21.91 52.7,22.23 52.7,24.77 53.34,25.4 v71.75,25.4
  other vias: 50.8,21.91 46.99,21.91
VSOL_MEA  (via drill 0.65)
  Top 0.254: C14.1 77.16,21.91 78.74,23.5 78.74,38.1 76.2,40.64 76.2,51.44 78.11,53.34 R17.2
  Bottom 0.254: R16.2 R17.2 | C14.1 54.61,20.95 53.98,20.32 49.53,20.32 48.53,19.32 ESP32-DEVKITV1.21 48.53,14.96 48.9,14.61 50.16,14.61 50.8,13.97 52.07,13.97 52.7,13.34 53.98,13.34 55.24,12.06 CON1.32
  other vias: 54.61,21.91 78.42,53.34

### Text on the board
tPlace: MAIN SWITCH / (ON <-> OFF) | PPTC FUSE / (72V / 1.1A) | BATTERY / INPUT (1S) | CN3065 | SOLAR CHARGE CONTROLLER | POWER INDICATOR | MICROCONTROLLER UNIT | ESP32 DEVKITV1
bPlace: STEP-UP VOLTAGE REGULATOR | STEP-DOWN VOLTAGE REGULATOR